# EAGLE schematic Sensor_board_2_V_1_0 (EAGLE 9.6.2)
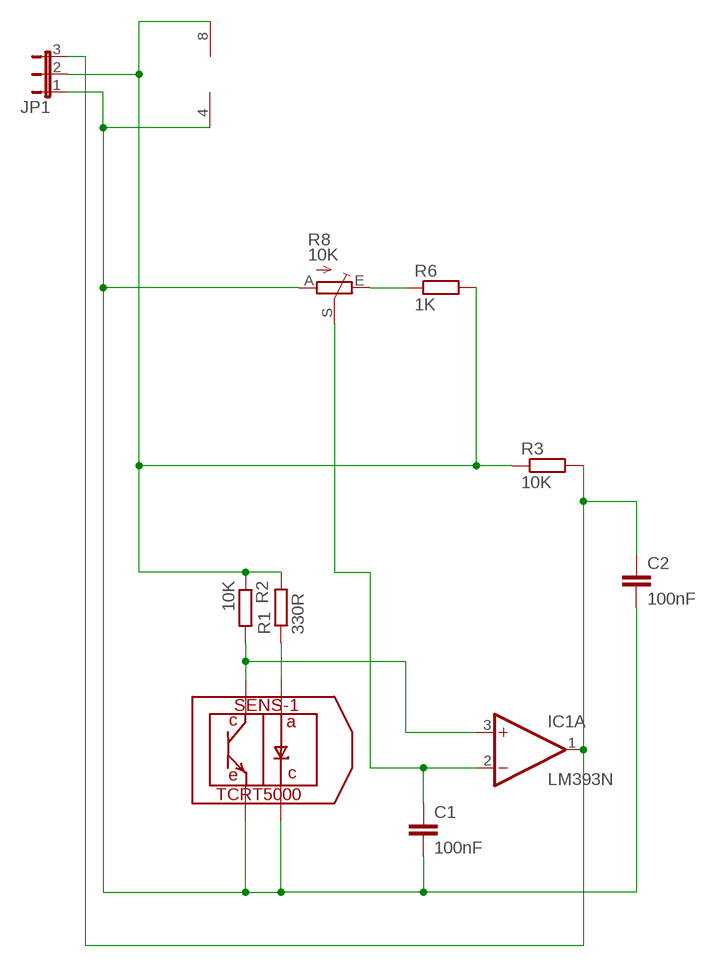
[diagram p0: schematic, sheet 1]

## Parts
C1  100nF  C-EU025_050-025X075  [C025_050-025X075]
C2  100nF  C-EU025_050-025X075  [C025_050-025X075]
IC1  LM393N  [DIL08]
JP1  JP2E  [JP2]
R1  330R  R-EU_0309/10  [0309/10]
R2  10K  R-EU_0309/10  [0309/10]
R3  10K  R-EU_0309/10  [0309/10]
R6  1K  R-EU_0309/10  [0309/10]
R8  10K  TRIM_EU-B64Y  [B64Y]
SENS-1  TCRT5000  [5000]

## Nets
N$1: IC1.8(P:V+) JP1.2 R1.2 R2.1 R3.1 R6.2
N$3: C1.2 C2.2 IC1.4(P:V-) JP1.1 R8.A SENS-1.P$2 SENS-1.P$4
N$4: R1.1 SENS-1.P$3
N$5: IC1.3(A:+IN) R2.2 SENS-1.P$1
N$6: C2.1 IC1.1(A:OUT) JP1.3 R3.2
N$8: R6.1 R8.E
N$9: C1.1 IC1.2(A:-IN) R8.S
Unconnected: IC1.5(B:+IN) IC1.6(B:-IN) IC1.7(B:OUT)

## Library data of the parts
C1 C2 = resistor:C-EU: CAPACITOR, European symbol
IC1 = linear4:LM393: COMPARATOR
JP1 = jumper:JP2E: JUMPER
R1-R3 R6 = resistor:R-EU_: RESISTOR, European symbol
R8 = pot:TRIM_EU-: POTENTIOMETER
SENS-1 = qfm-trx1-24g:TCRT5000: Reflective Optical Sensor with Transistor Output. Vishay Semiconductors